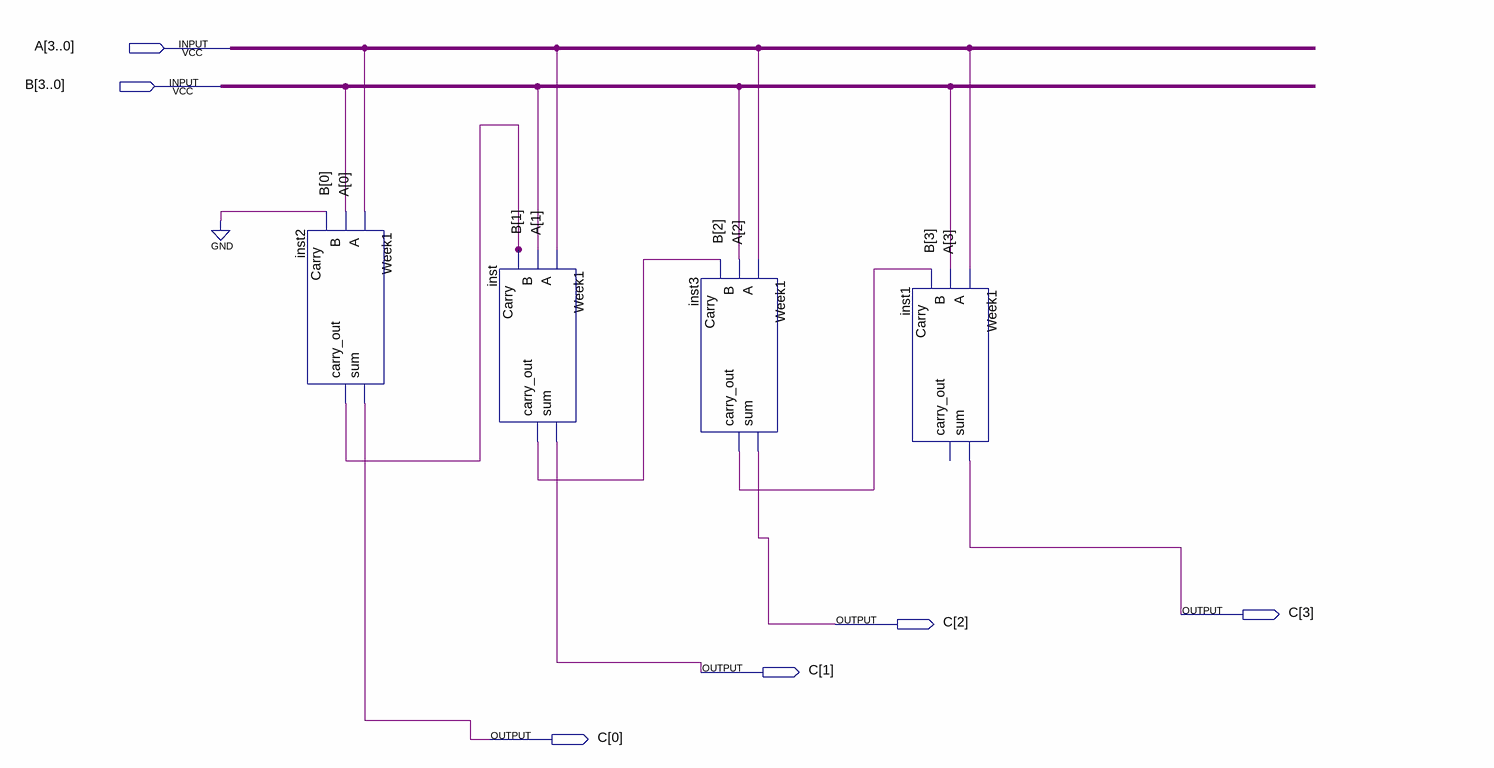
[diagram p0: schematic sheet]
// Quartus schematic FourBitAdder.bdf as structural Verilog: 4 symbols, 6 pins
module FourBitAdder (
  input  [3:0] A,
  input  [3:0] B,
  output [3:0] C
);

  wire inst2_carry_out, inst3_carry_out, inst_carry_out;

  Week1 inst2 (.A(A[0]), .B(B[0]), .Carry(1'b0), .sum(C[0]), .carry_out(inst2_carry_out));
  Week1 inst (.A(A[1]), .B(B[1]), .Carry(inst2_carry_out), .sum(C[1]), .carry_out(inst_carry_out));
  Week1 inst3 (.A(A[2]), .B(B[2]), .Carry(inst_carry_out), .sum(C[2]), .carry_out(inst3_carry_out));
  Week1 inst1 (.A(A[3]), .B(B[3]), .Carry(inst3_carry_out), .sum(C[3]));  // open: carry_out
endmodule
